# Altium schematic sheet FPGA_Ground.SchDoc: FPGA Ground
size A portrait; Organization: UCLA High Energy Physics; DocumentNumber: 22; Revision: 2.0; SheetNumber: 22; SheetTotal: 23; CurrentDate: 9/6/2018; ModifiedDate: 9/6/2018; ProjectName: OALCT S-6 Mezzanine
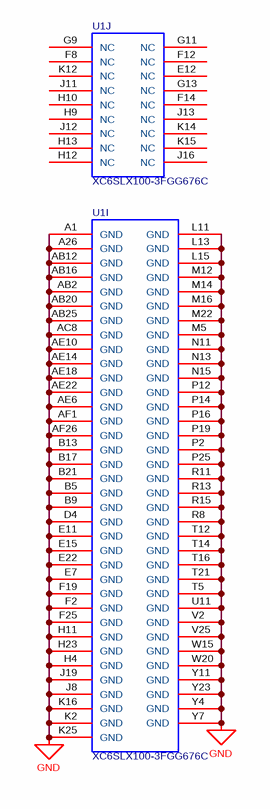
[diagram p0: FPGA_Ground.SchDoc]

## Parts
U1  XC6SLX100-3FGG676C  [FGG676]  (parts I,J of 10)

## Nets
GND: U1.A1(GND) U1.A26(GND) U1.AB2(GND) U1.AB12(GND) U1.AB16(GND) U1.AB20(GND) U1.AB25(GND) U1.AC8(GND) U1.AE6(GND) U1.AE10(GND) U1.AE14(GND) U1.AE18(GND) U1.AE22(GND) U1.AF1(GND) U1.AF26(GND) U1.B5(GND) U1.B9(GND) U1.B13(GND) U1.B17(GND) U1.B21(GND) U1.D4(GND) U1.E7(GND) U1.E11(GND) U1.E15(GND) U1.E22(GND) U1.F2(GND) U1.F19(GND) U1.F25(GND) U1.H4(GND) U1.H11(GND) U1.H23(GND) U1.J8(GND) U1.J19(GND) U1.K2(GND) U1.K16(GND) U1.K25(GND) U1.L11(GND) U1.L13(GND) U1.L15(GND) U1.M5(GND) U1.M12(GND) U1.M14(GND) U1.M16(GND) U1.M22(GND) U1.N11(GND) U1.N13(GND) U1.N15(GND) U1.P2(GND) U1.P12(GND) U1.P14(GND) U1.P16(GND) U1.P19(GND) U1.P25(GND) U1.R8(GND) U1.R11(GND) U1.R13(GND) U1.R15(GND) U1.T5(GND) U1.T12(GND) U1.T14(GND) U1.T16(GND) U1.T21(GND) U1.U11(GND) U1.V2(GND) U1.V25(GND) U1.W15(GND) U1.W20(GND) U1.Y4(GND) U1.Y7(GND) U1.Y11(GND) U1.Y23(GND)

Not connected (* = marked no-connect by the designer): U1 E12(NC) F8(NC) F12(NC) F14(NC) G9(NC) G11(NC) G13(NC) H9(NC) H10(NC) H12(NC) H13(NC) J11(NC) J12(NC) J13(NC) J16(NC) K12(NC) K14(NC) K15(NC)

## Notes on the sheet
- Date:
- Rev:
- of
- Sheet

## Library data of the parts
U1 = XC6SLX100-3FGG676C: Manufacturer: Xilinx Inc.; Voltage - Supply: 1.14 V ~ 1.26 V; Supplier 1: Digi-Key; Manufacturer Part Number: XC6SLX100-3FGG676C; RoHS: RoHS Compliant; Category: Integrated Circuits (ICs); Stock 1: 275; Pricing 1: 1=145.6 (USD); Part Status: Active; Mounting Type: Surface Mount; Operating Temperature: 0°C ~ 85°C (TJ); Package / Case: 676-BGA; Supplier Device Package: 676-FBGA (27x27); ComponentLink1URL: http://www.xilinx.com/support/documentation/data_sheets/ds162.pdf; ComponentLink1Description: http://www.xilinx.com/support/documentation/data_sheets/ds162.pdf; Supplier Part Number 1: 122-1760-ND